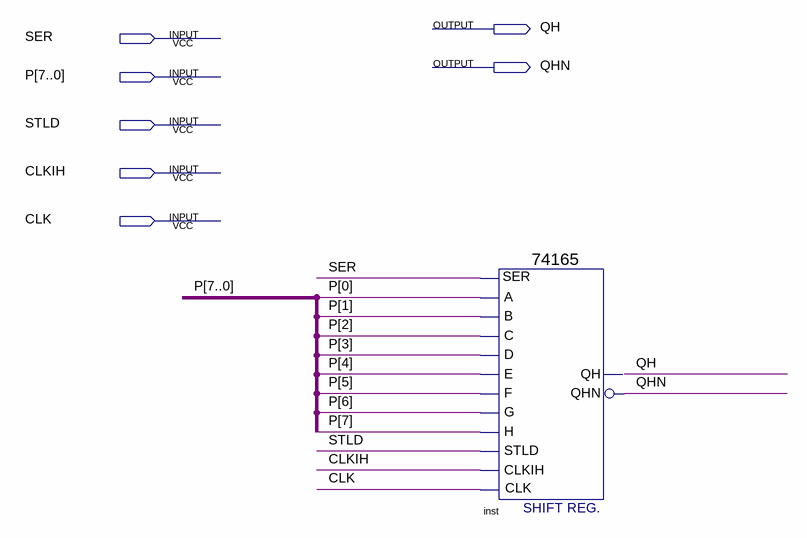
[diagram p0: schematic sheet]
// Quartus schematic ttl74165.bdf as structural Verilog: 1 symbols, 7 pins
module ttl74165 (
  input  SER,
  input  [7:0] P,
  input  STLD,
  input  CLKIH,
  input  CLK,
  output QH,
  output QHN
);

  \74165  inst (
    .D(P[3]), .C(P[2]), .B(P[1]), .G(P[6]), .H(P[7]), .A(P[0]), .CLKIH(CLKIH), .E(P[4]), .F(P[5]), .CLK(CLK),
    .STLD(STLD), .SER(SER), .QH(QH), .QHN(QHN));
endmodule
